# EAGLE design ESP12F-SIMPLE-ACT4088 (EAGLE 7.7.0)
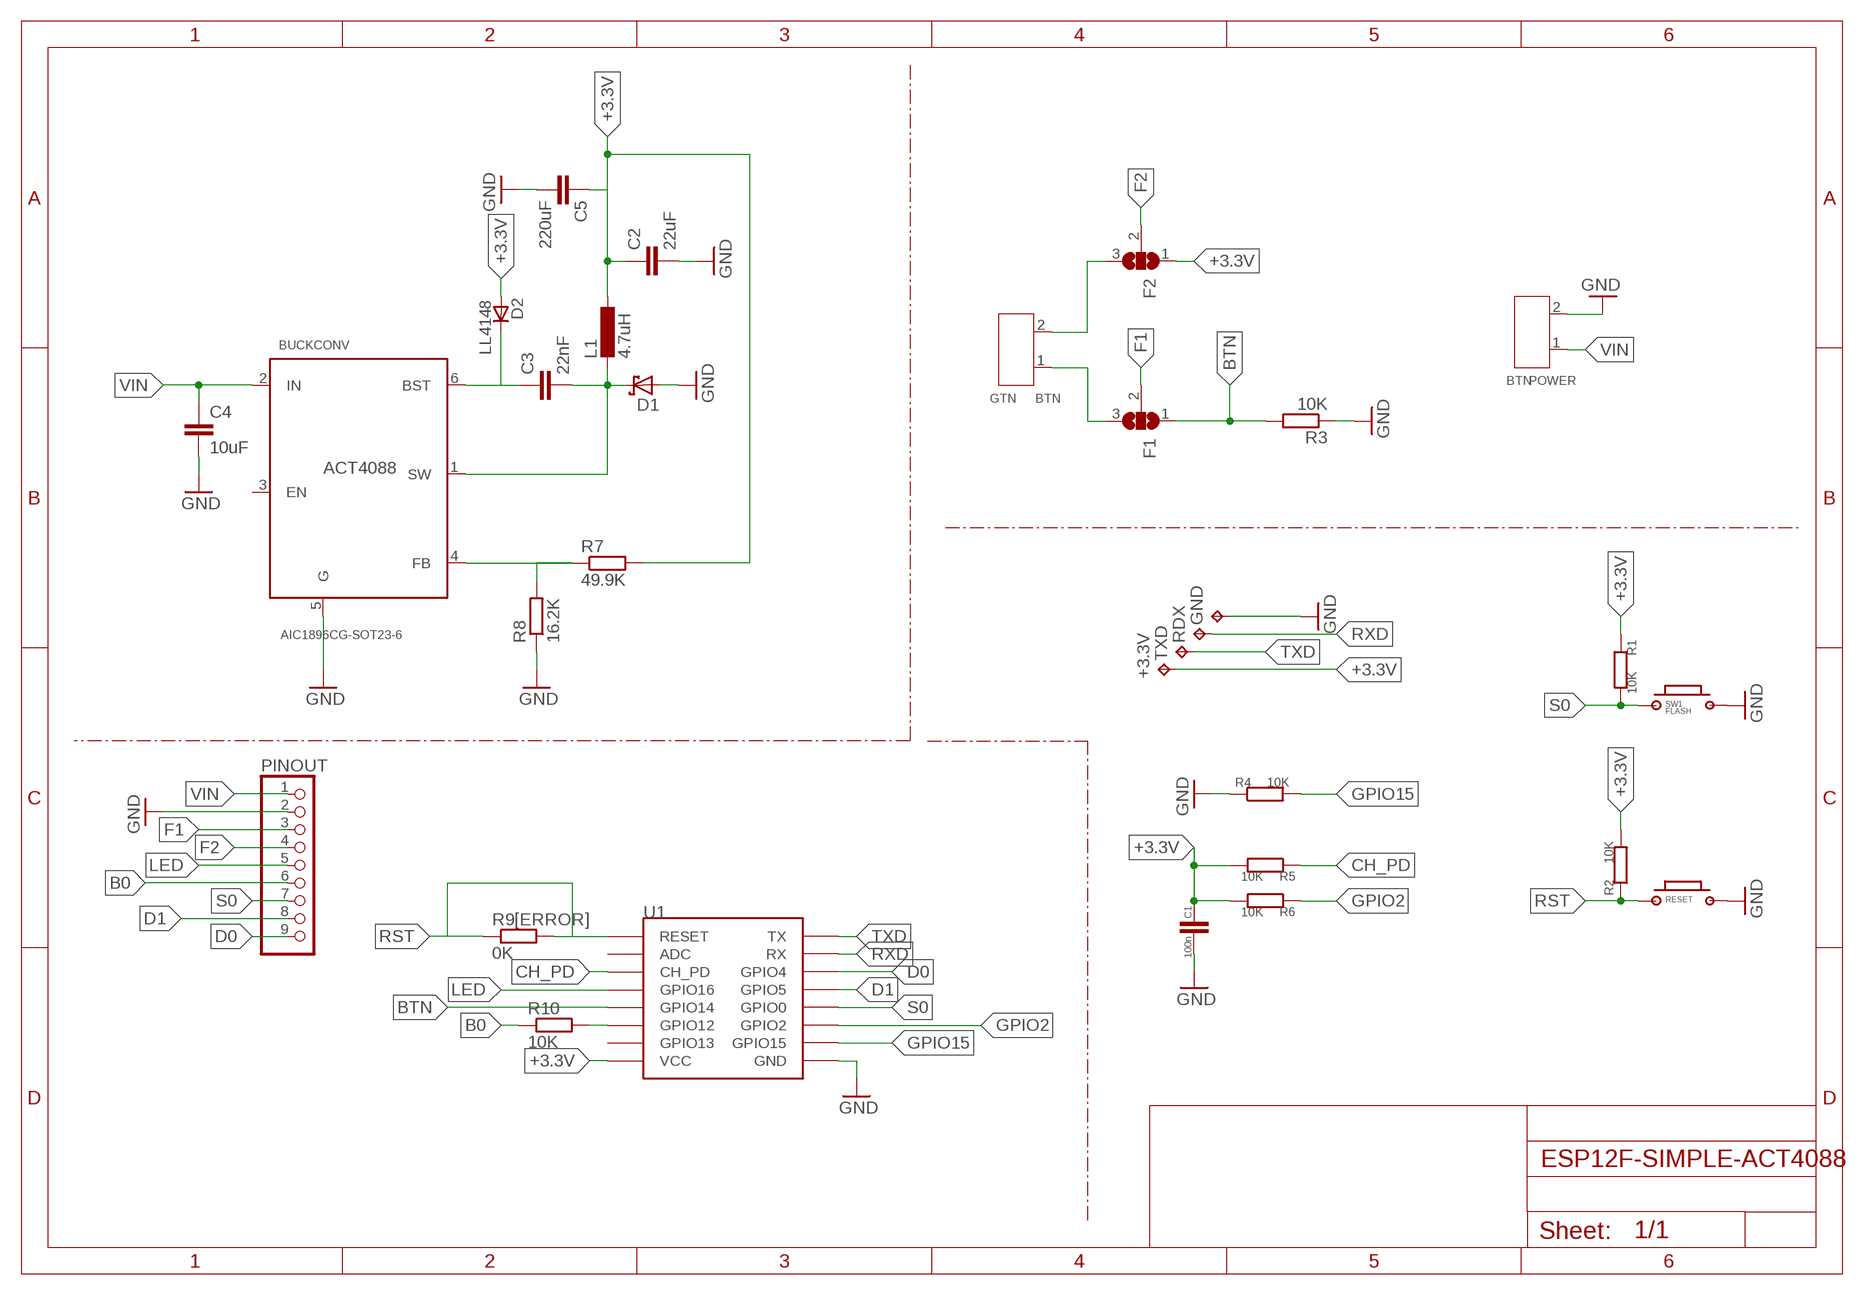
[diagram p0: schematic, sheet 1]

## Parts
+3.3V  TPTP15R  [TP15R]
BTN  GTN  SCREW-TERMINAL-GREEN(2P-3.5)  [H2-3.5-7.0X7.0MM]
BUCKCONV  AIC1896CG-SOT23-6  ACT4088-(SOT23-6)  [SOT-23-6]
C1  100n  CAPC0805  [C_0805]
C2  22uF  C-EUC0805K  [C0805K]
C3  22nF  C-EUC0805K  [C0805K]
C4  10uF  C-EUC0805K  [C0805K]
C5  220uF  C-EUC1210  [C1210]
D1  SCHOTTKY-DIODESMD  [SMB]
D2  LL4148  [SOD80_DO213AA_MINIMELF]
F1  SJ2WX  [SJ_2XX]
F2  SJ2WX  [SJ_2XX]
GND  TPTP15R  [TP15R]
L1  4.7uH  L-EUL3225M  [L3225M]
PINOUT  PINHD-1X9  [1X09]
POWER  BTN  SCREW-TERMINAL-GREEN(2P-3.5)  [H2-3.5-7.0X7.0MM]
R1  10K  RESISTORR0805  [R_0805]
R2  10K  RESISTORR0805  [R_0805]
R3  10K  R-EU_R0805  [R0805]
R4  10K  RESISTORR0805  [R_0805]
R5  10K  RESISTORR0805  [R_0805]
R6  10K  RESISTORR0805  [R_0805]
R7  49.9K  R-EU_R0805  [R0805]
R8  16.2K  R-EU_R0805  [R0805]
R9[ERROR]  0K  R-EU_R0805  [R0805]
R10  10K  R-EU_R0805  [R0805]
RDX  TPTP15R  [TP15R]
RESET  BUTTON-2PSWITCH-TURTLE-2P  [2P-SWITCH-TURTLE]
SW1  FLASH  BUTTON-2PSWITCH-TURTLE-2P  [2P-SWITCH-TURTLE]
TXD  TPTP15R  [TP15R]
U1  ESP12SMD  [ESP12-SMD]

## Nets
+3.3V: +3.3V.TP C1.1 C2.1 C5.1 D2.A F2.1 L1.1 R1.1 R2.2 R5.2 R6.2 R7.2 U1.VCC
B0: PINOUT.6 R10.1
BTN: F1.1 R3.2 U1.GPIO14
CH_PD: R5.1 U1.CH_PD
D0: PINOUT.9 U1.GPIO4
D1: PINOUT.8 U1.GPIO5
F1: F1.2 PINOUT.3
F2: F2.2 PINOUT.4
GND: BUCKCONV.5(G) C1.2 C2.2 C4.2 C5.2 D1.A GND.TP PINOUT.2 POWER.2 R3.1 R4.1 R8.1 RESET.2 SW1.2 U1.GND
GPIO2: R6.1 U1.GPIO2
GPIO15: R4.2 U1.GPIO15
LED: PINOUT.5 U1.GPIO16
N$2: BUCKCONV.1(SW) C3.2 D1.C L1.2
N$3: R10.2 U1.GPIO12
N$4: BUCKCONV.6(BST) C3.1 D2.C
N$5: BUCKCONV.4(FB) R7.1 R8.2
N$6: BTN.1 F1.3
N$7: BTN.2 F2.3
RST: R2.1 R9[ERROR].1 R9[ERROR].2 RESET.1 U1.RESET
RXD: RDX.TP U1.RXD0(RX)
S0: PINOUT.7 R1.2 SW1.1 U1.GPIO0
TXD: TXD.TP U1.TXD0(TX)
VIN: BUCKCONV.2(IN) C4.1 PINOUT.1 POWER.1
Unconnected: BUCKCONV.3(EN) U1.ADC U1.GPIO13

## Library data of the parts
+3.3V GND RDX TXD = testpad:TP: Test pad
BTN POWER = Seeed-Connector -2016:SCREW-TERMINAL-GREEN(2P-3.5): 320110028; VALUE: GREEN-2P-3.5
BUCKCONV = Seeed-IC-2016:ACT4088-(SOT23-6): 310030104; MPN: AIC1896CG
C1 = PRT-RCL:CAP
C2-C4 = rcl:C-EU: CAPACITOR, European symbol
C5 = resistor:C-EU: CAPACITOR, European symbol
D1 = diode:SCHOTTKY-DIODE: Schottky Diode
D2 = _hhn_diodes_smd:LL4148: 1N4148 General Purpose Rectifie SMD-Version of 1N4148 Case: SOD 80 = DO 213 AA = MINIMELF (Glass) Author: Dipl.-Ing. FH Rainer Bayer HHN Hochschule Heilbronn, rainer.bayer@hs-heilbronn.de Ingenieurbüro ing-rb, mail@ing-rb.de
F1 F2 = jumper:SJ2WX: SMD solder JUMPER
L1 = rcl:L-EU: INDUCTOR, European symbol
PINOUT = pinhead:PINHD-1X9: PIN HEADER
R1 R2 R4-R6 = PRT-RCL:RESISTOR
R3 R7 R8 R9[ERROR] R10 = resistor:R-EU_: RESISTOR, European symbol
RESET SW1 = PRT-Switch:BUTTON-2P
U1 = esp8266modules:ESP12: ESP8266 Wifi module 12

## Net classes
0 default: width 0.305 mm, drill 0.508 mm, clearance 0.254 mm
1 VCC: width 0.457 mm, clearance 0.254 mm

## Board
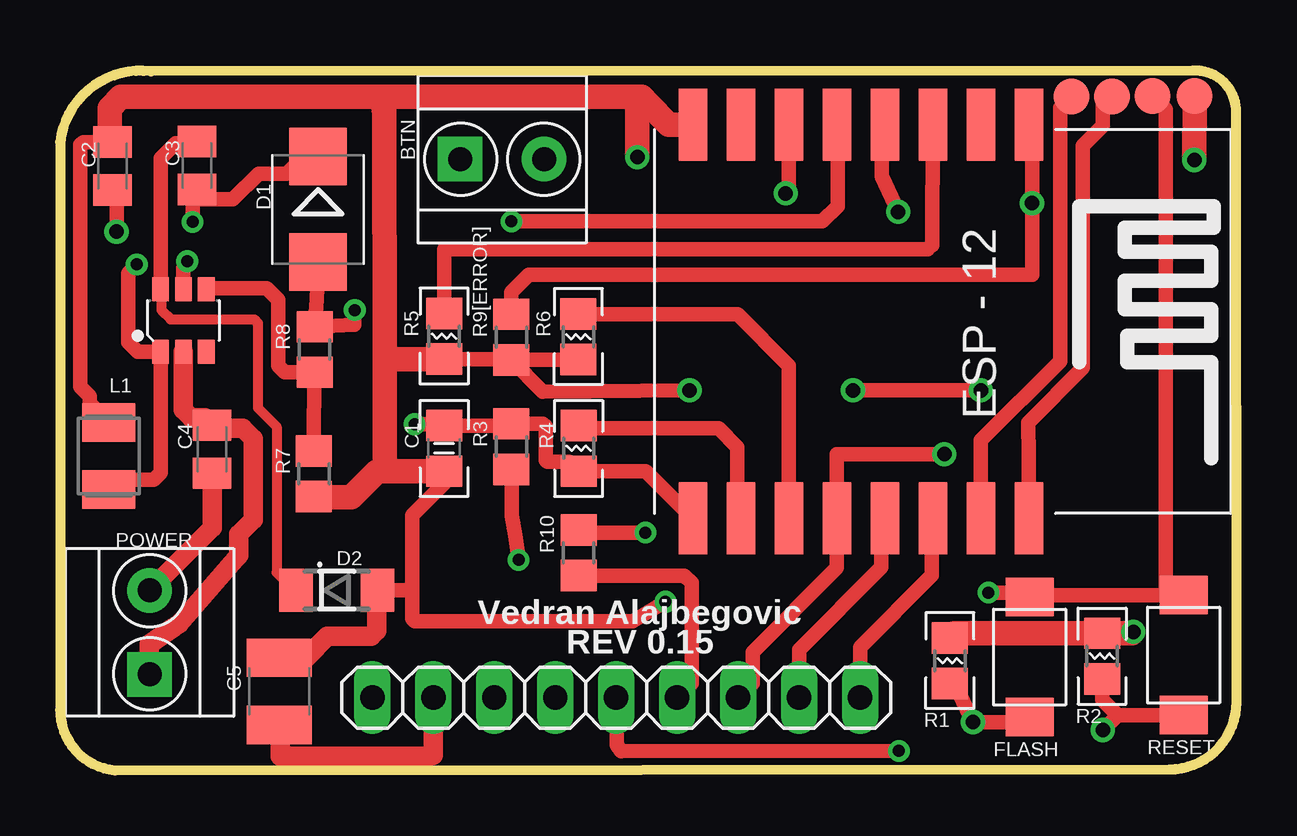
[diagram p1: board, top side]
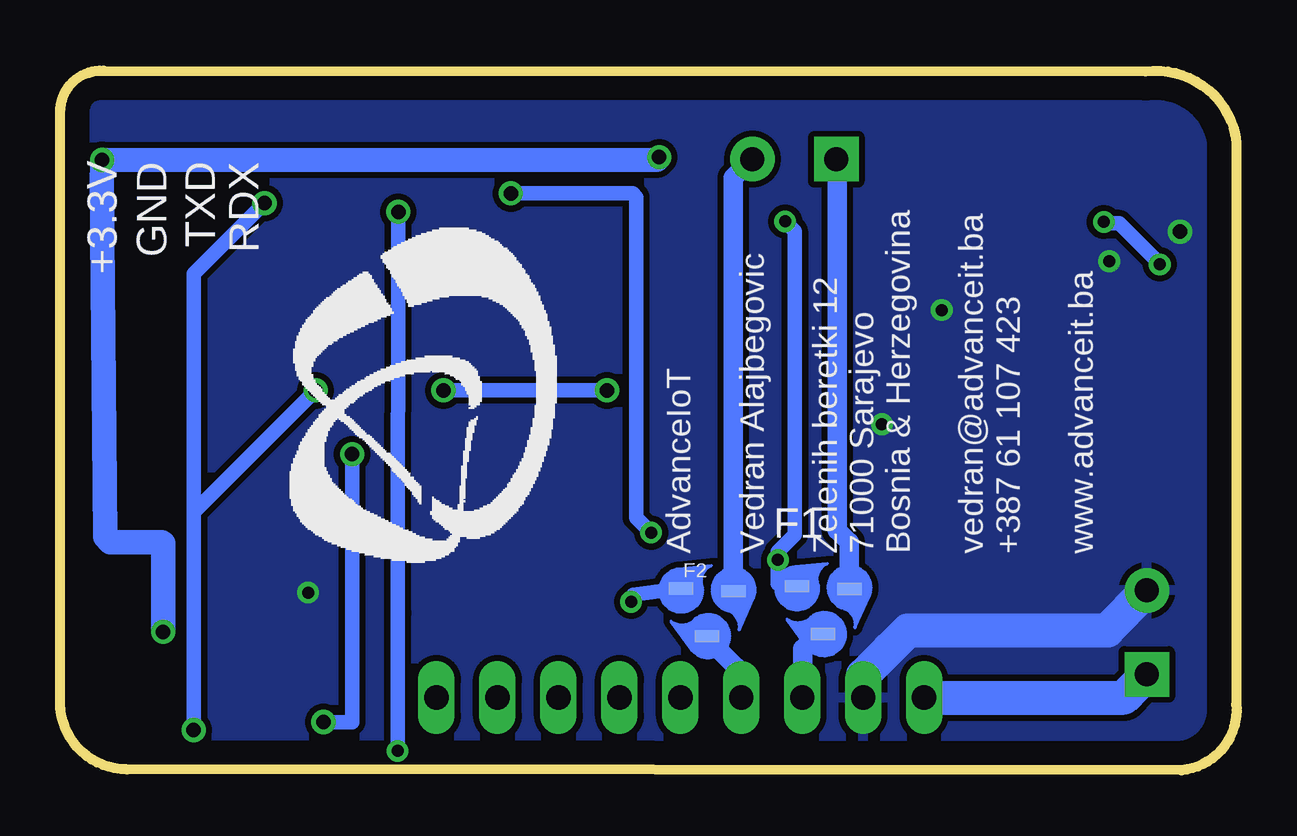
[diagram p2: board, bottom side, seen from below]

Size 49.02 x 29.15 mm. Coordinates in mm from the lower left corner, seen from the top.
Outline: 0,26.17 0.01,2.75 arc90 2.29,0 46.23,0.04 arc90 49.02,2.83 49,27.56 arc90 47.21,29.15 3.79,29.12 arc90 0,26.17
Copper layers (1*16): Top 0.035mm / dielectric 1.5mm / Bottom 0.035mm
Design rules "default": minimum track width 10mil, minimum drill 24mil, track to track 8mil, track to pad 8mil, pad to pad 8mil, via to via 8mil, smd to smd 8mil, copper to edge 40mil, drill to drill 8mil, minimum pad ring 10mil, minimum via ring 8mil, stop-mask expansion 4mil, vias tented up to drill 0mil, thermal gap 10mil

### Footprints (pad centres in the part's own frame; a part is rotated, then mirrored left to right if it is on the bottom)
TP15R = smd 1.5 x 1.5: TP 0,0
H2-3.5-7.0X7.0MM = drill 1 pad 1.85 square: 1 -1.75,0 | drill 1 pad 1.85: 2 1.75,0
SOT-23-6 = smd 0.69 x 1: 1 -0.95,-1.3; 2 0,-1.3; 3 0.95,-1.3; 4 0.95,1.3; 5 0,1.3; 6 -0.95,1.3
C_0805 = smd 1.3 x 1.5: 1 -0.95,0; 2 0.95,0
C0805K = smd 1.3 x 1.6: 1 -1,0; 2 1,0
C1210 = smd 1.6 x 2.7: 1 -1.4,0; 2 1.4,0
SMB = smd 2.4 x 2.4: A 2.2,0; C -2.2,0
SOD80_DO213AA_MINIMELF = smd 1.4 x 1.8: A 1.7,0; C -1.7,0
SJ_2XX = smd 1.016 x 0.508: 1 -1.114,0.72; 2 -0.04,-1.27; 3 1.064,0.61
L3225M = smd 1.6 x 2.2: 1 -1.4,0; 2 1.4,0
1X09 = drill 1.016 long: 1 -10.16,0; 2 -7.62,0; 3 -5.08,0; 4 -2.54,0; 5 0,0; 6 2.54,0; 7 5.08,0; 8 7.62,0; 9 10.16,0
R_0805 = smd 1.3 x 1.5: 1 -0.95,0; 2 0.95,0
R0805 = smd 1.3 x 1.5: 1 -0.95,0; 2 0.95,0
2P-SWITCH-TURTLE = smd 1.6 x 2: 1 -0.5,-1.5; 2 4.5,-1.5
ESP12-SMD = smd 3 x 1.2: ADC -8.3,3.8; CH_PD -8.3,1.8; GND 8.1,-8.2; GPIO0 8.1,-2.2; GPIO2 8.1,-4.2; GPIO4 8.1,1.8; GPIO5 8.1,-0.2; GPIO12 -8.3,-4.2; GPIO13 -8.3,-6.2; GPIO14 -8.3,-2.2; GPIO15 8.1,-6.2; GPIO16 -8.3,-0.2; RESET -8.3,5.8; RXD0 8.1,3.8; TXD0 8.1,5.8; VCC -8.3,-8.2

### Placement (x,y rotation side)
+3.3V  47.26,28.08 0 top
BTN  18.42,25.46 0 top
BUCKCONV  5.14,18.73 0 top
C1  16,13.42 90 top
C2  2.18,25.17 270 top
C3  5.7,25.2 270 top
C4  6.33,13.38 270 top
C5  9.13,3.29 270 top
D1  10.75,23.38 270 top
D2  11.53,7.5 0 top
F1  17.19,6.95 0 bottom
F2  22.02,6.86 0 bottom
GND  45.51,28.09 0 top
L1  2.03,13.1 270 top
PINOUT  23.17,3.02 0 top
POWER  3.73,5.75 90 top
R1  37.07,4.57 270 top
R2  43.42,4.76 90 top
R3  18.8,13.49 270 top
R4  21.61,13.42 90 top
R5  16,18.08 270 top
R6  21.59,18.06 270 top
R7  10.57,12.36 270 top
R8  10.6,17.54 270 top
R9[ERROR]  18.8,18.04 90 top
R10  21.6,9.06 90 top
RDX  42.14,28.07 0 top
RESET  45.31,2.79 90 top
SW1  38.9,2.71 90 top
TXD  43.82,28.07 0 top
U1  34.57,18.6 270 top

### Tracks (layer width: path | path; a pad name or v marks a point on that pad's centre or on a via)
+3.3V  (via drill 0.5, 0.6)
  Top 0.61: C2.1 0.96,26.17 0.84,26.05 0.84,15.99 1.24,15.59 1.24,15.29 L1.1 | 21.57,17.09 R6.2 21.59,17.09 18.76,17.09 18.76,17.13 R5.2 | C1.1 16,11.96 14.67,10.62 14.67,7.5 | 14.67,7.5 14.67,6.32 14.78,6.21 23.87,6.21 v25.22,7.03 | D2.A 14.67,7.5
  Top 0.813: C5.1 10.25,4.69 11.14,5.58 12.96,5.58 13.19,5.81 13.19,7.46 D2.A
  Top 1.016: U1.VCC 25.36,26.9 24.5,27.76 24.23,28.05 | 24.23,28.05 13.4,28.05 | 13.4,28.05 2.53,28.05 2.06,27.58 2.06,26.29 C2.1 | C1.1 13.68,12.46 13.53,12.46 | 13.53,12.46 13.53,17.2 | 13.53,17.2 13.51,27.41 13.4,28.05 | 13.53,12.46 13.19,12.45 12.13,11.38 10.51,11.38 R7.2 | R5.2 13.72,17.13 13.53,17.2 | v24.05,25.54 24.05,27.57 24.23,28.05 | v47.26,25.42 47.27,28.07 +3.3V.TP | v44.72,5.77 44.66,5.71 R2.2 37.26,5.71 R1.1
  Bottom 0.61: v25.22,7.03 25.14,7.31 F2.1
  Bottom 1.016: v24.05,25.54 24.16,25.45 v47.26,25.42 47.28,24.41 47.14,9.72 46.92,9.51 44.77,9.51 44.72,9.46 v44.72,5.77
B0
  Top 0.61: PINOUT.6 26.31,3.62 26.31,7.82 26.01,8.12 R10.1
BTN  (via drill 0.5)
  Top 0.61: v19.1,8.77 18.96,9.79 18.81,10.6 18.81,11.26 R3.2 | U1.GPIO14 32.41,26.87 32.41,23.51 31.77,22.87 v18.81,22.87
  Bottom 0.61: F1.1 19.12,7.77 v19.1,8.77 19.1,9.11 18.41,9.81 18.41,22.47 v18.81,22.87
CH_PD
  Top 0.61: R5.1 16,21.71 16.42,21.71 36.16,21.7 36.34,21.88 U1.CH_PD
D0
  Top 0.61: PINOUT.9 33.33,5.14 36.32,8.12 36.32,10.46 U1.GPIO4
D1
  Top 0.61: PINOUT.8 30.79,5.03 34.22,8.46 34.22,10.36 U1.GPIO5
F1
  Bottom 0.813: PINOUT.3 18.08,3.04 18.08,5.06 17.46,5.68 F1.2
F2
  Bottom 0.813: PINOUT.4 20.84,3.23 20.84,4.3 22.06,5.52 F2.2
GND  (via drill 0.5, 0.6)
  Top 0.61: RESET.2 46.07,7.29 | 46.07,7.29 40.48,7.29 SW1.2 40.21,7.41 v38.68,7.41 | D1.A 10.69,19.61 R8.1 12.26,18.56 v12.28,19.17 | v2.35,22.45 2.35,24 C2.2 | BUCKCONV.5 5.14,20.93 v5.3,21.2 | v14.77,14.42 15.95,14.42 C1.2 18.73,14.37 R3.1 20.12,14.44 20.23,14.33 20.23,12.93 20.29,12.87 21.21,12.87 R4.1 24.41,12.46 U1.GND | GND.TP 46.07,27.54 46.07,7.29
  Top 0.813: C4.2 6.33,10.12 POWER.2 | C5.2 9.17,1.89 9.17,0.58 15.39,0.58 15.39,0.62 15.55,0.62 PINOUT.2
  Bottom 1.422: PINOUT.2 15.55,3.97 14.47,5.04 14.46,5.04 13.68,5.83 5.38,5.83 POWER.2
  pour Bottom: 49.04,29.25 0.06,29.16 -0.11,-0.01 48.92,-0.06
GPIO2
  Top 0.61: R6.1 21.61,18.99 28.23,18.99 30.37,16.85 U1.GPIO2
GPIO15
  Top 0.61: R4.2 21.73,14.25 27.44,14.25 28.22,13.46 28.22,10.66 U1.GPIO15
LED  (via drill 0.5, 0.6)
  Top 0.61: PINOUT.5 23.22,2.98 23.19,1.06 23.38,0.8 v34.95,0.81 | v34.92,23.26 34.24,24.74 34.24,26.34 34.37,26.47 U1.GPIO16
  Bottom 0.61: v34.95,0.81 34.95,1.49 | 34.95,1.54 34.95,1.49 | 34.95,1.49 34.94,6.56 v34.92,23.26
N$2  (via drill 0.5)
  Top 0.61: L1.2 2.45,12.12 3.91,12.12 4.19,12.39 BUCKCONV.1 3.23,17.43 2.83,17.83 2.83,20.71 v3.19,21.07 | D1.C 10.51,25.91 9.45,24.85 8.27,24.85 7.2,23.79 5.71,23.79 C3.2 5.52,23.89 v5.52,22.84
  Bottom 0.61: v3.19,21.07 3.19,21.09 4.88,22.79 5.46,22.79 v5.52,22.84
N$3  (via drill 0.5, 0.6)
  Top 0.61: R10.2 21.71,9.91 v24.39,9.91 | v30.23,24.04 30.37,24.17 U1.GPIO12
  Bottom 0.61: v24.39,9.91 25.01,10.53 25.01,23.88 25.16,24.04 v30.23,24.04
N$4
  Top 0.406: BUCKCONV.6 4.22,20 4.22,19.17 4.61,18.79 8.09,18.79 8.24,18.63 8.24,15.1 9.02,14.31 9.02,8.24 9.35,7.91 9.35,7.5 D2.C
  Top 0.61: BUCKCONV.6 4.19,25.49 4.82,26.12 5.37,26.12 C3.1
N$5
  Top 0.61: R7.1 10.56,14.58 R8.2 9.35,16.58 9.09,16.84 9.09,19.59 8.6,20.08 6.14,20.08 BUCKCONV.4
N$6
  Bottom 0.813: BTN.1 16.63,25.42 16.63,10.01 16.13,9.51 F1.3
N$7
  Bottom 0.813: BTN.2 20.96,24.68 F2.3
RST  (via drill 0.6)
  Top 0.61: U1.RESET 40.5,26.9 v40.5,23.63 40.5,20.64 19.52,20.64 18.8,19.92 R9[ERROR].2 | v43.45,1.68 44.07,2.29 | 44.07,2.29 RESET.1 | 44.07,2.29 43.42,2.94 R2.1 | R9[ERROR].1 20.12,15.78 v26.23,15.83 | v33.04,15.83 v38.37,15.83
  Bottom 0.61: v40.5,23.63 43.45,20.68 43.45,10.75 | 43.45,10.75 v43.45,1.68 | v26.23,15.83 v33.04,15.83 | v38.37,15.83 43.45,10.75
RXD
  Top 0.61: RDX.TP 41.67,27.6 41.67,17.04 38.37,13.75 U1.RXD0
S0  (via drill 0.6)
  Top 0.61: PINOUT.7 28.86,3.63 28.86,4.93 32.37,8.44 U1.GPIO0 32.37,13.17 v36.85,13.17 | 37.38,3.4 v38.04,2.01 40.4,2.01 SW1.1
  Top 0.813: R1.2 37.38,3.4
  Bottom 0.61: v38.04,2.01 36.85,2.01 v36.85,13.17
TXD
  Top 0.61: TXD.TP 43.44,27.7 43.44,26.84 42.62,26.02 42.62,16.76 40.34,14.49 40.36,13.1 40.37,13.06 U1.TXD0
VIN
  Top 0.813: POWER.1 3.71,5.25 4.74,5.96 4.97,6.12 7.44,8.96 7.44,9.84 8.04,10.44 8.04,13.8 7.6,14.25 6.46,14.25 C4.1 6.02,14.69 5.47,14.69 5.14,15.02 BUCKCONV.2
  Bottom 1.422: PINOUT.1 4.68,3.02 POWER.1

### Text on the board
tNames: Vedran Alajbegovic / REV 0.15
bNames: AdvanceIoT / / Vedran Alajbegovic / / Zelenih beretki 12 / 71000 Sarajevo / Bosnia & Herzegovina / / vedran@advanceit.ba / +387 61 107 423 / / www.advanceit.ba